# Altium schematic sheet SL530_0.SchDoc: SL530
size 655 x 340 mm; Date: 20.02.2018 21:06:23; SheetNumber: 1
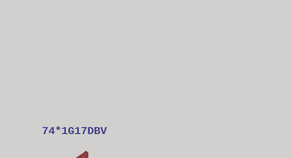
[diagram p0: SL530_0.SchDoc, top left]
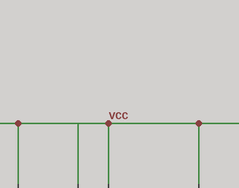
[diagram p1: SL530_0.SchDoc, top right]
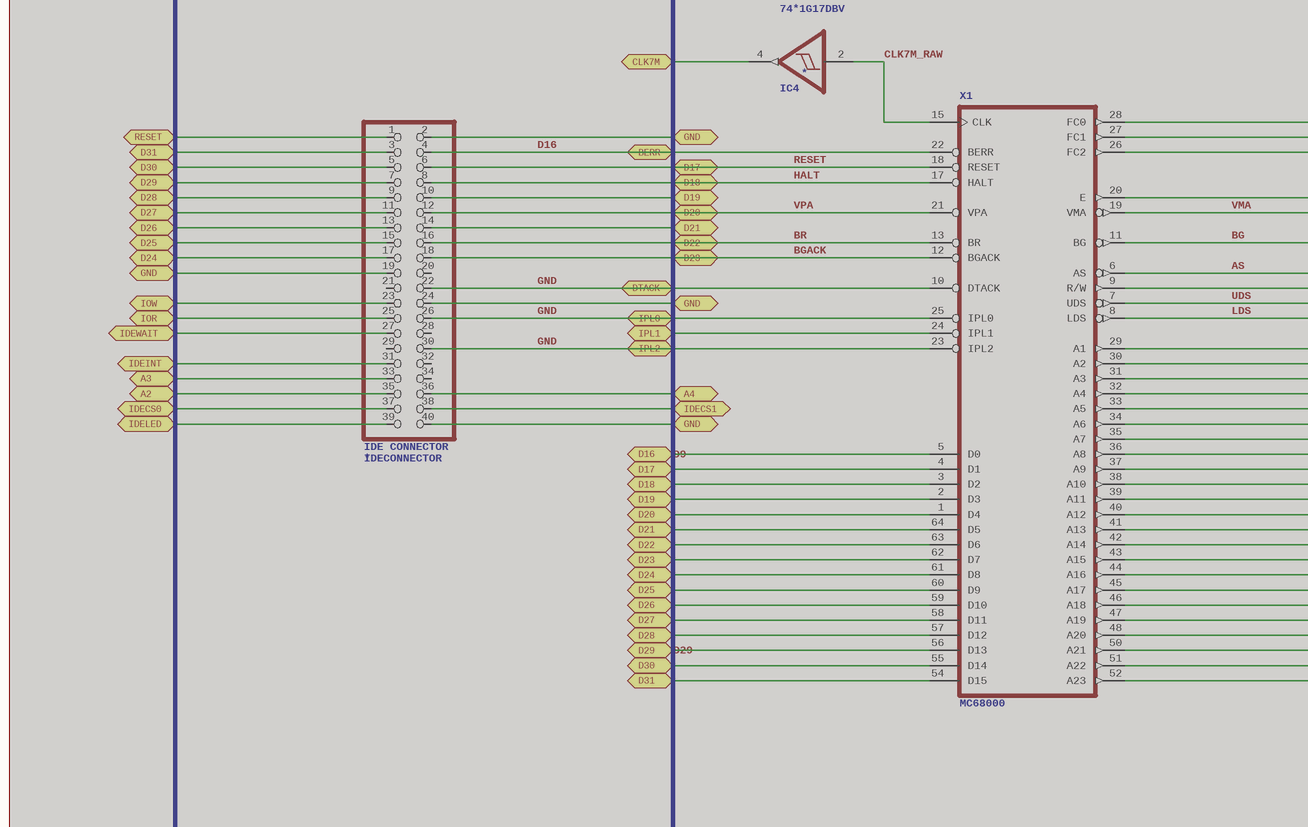
[diagram p2: SL530_0.SchDoc, bottom left]
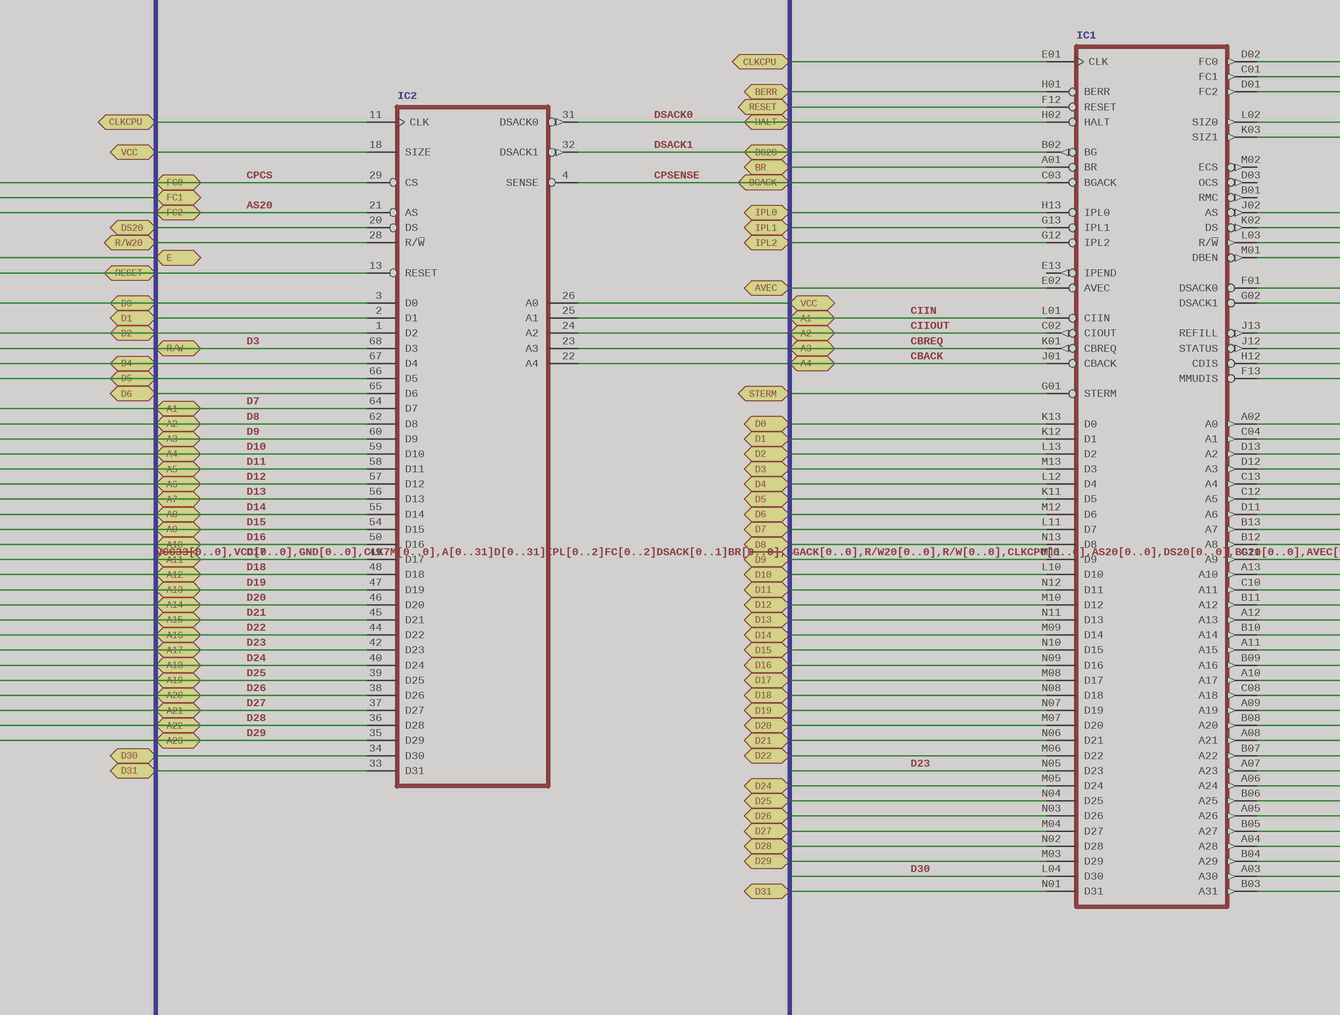
[diagram p3: SL530_0.SchDoc, bottom middle]
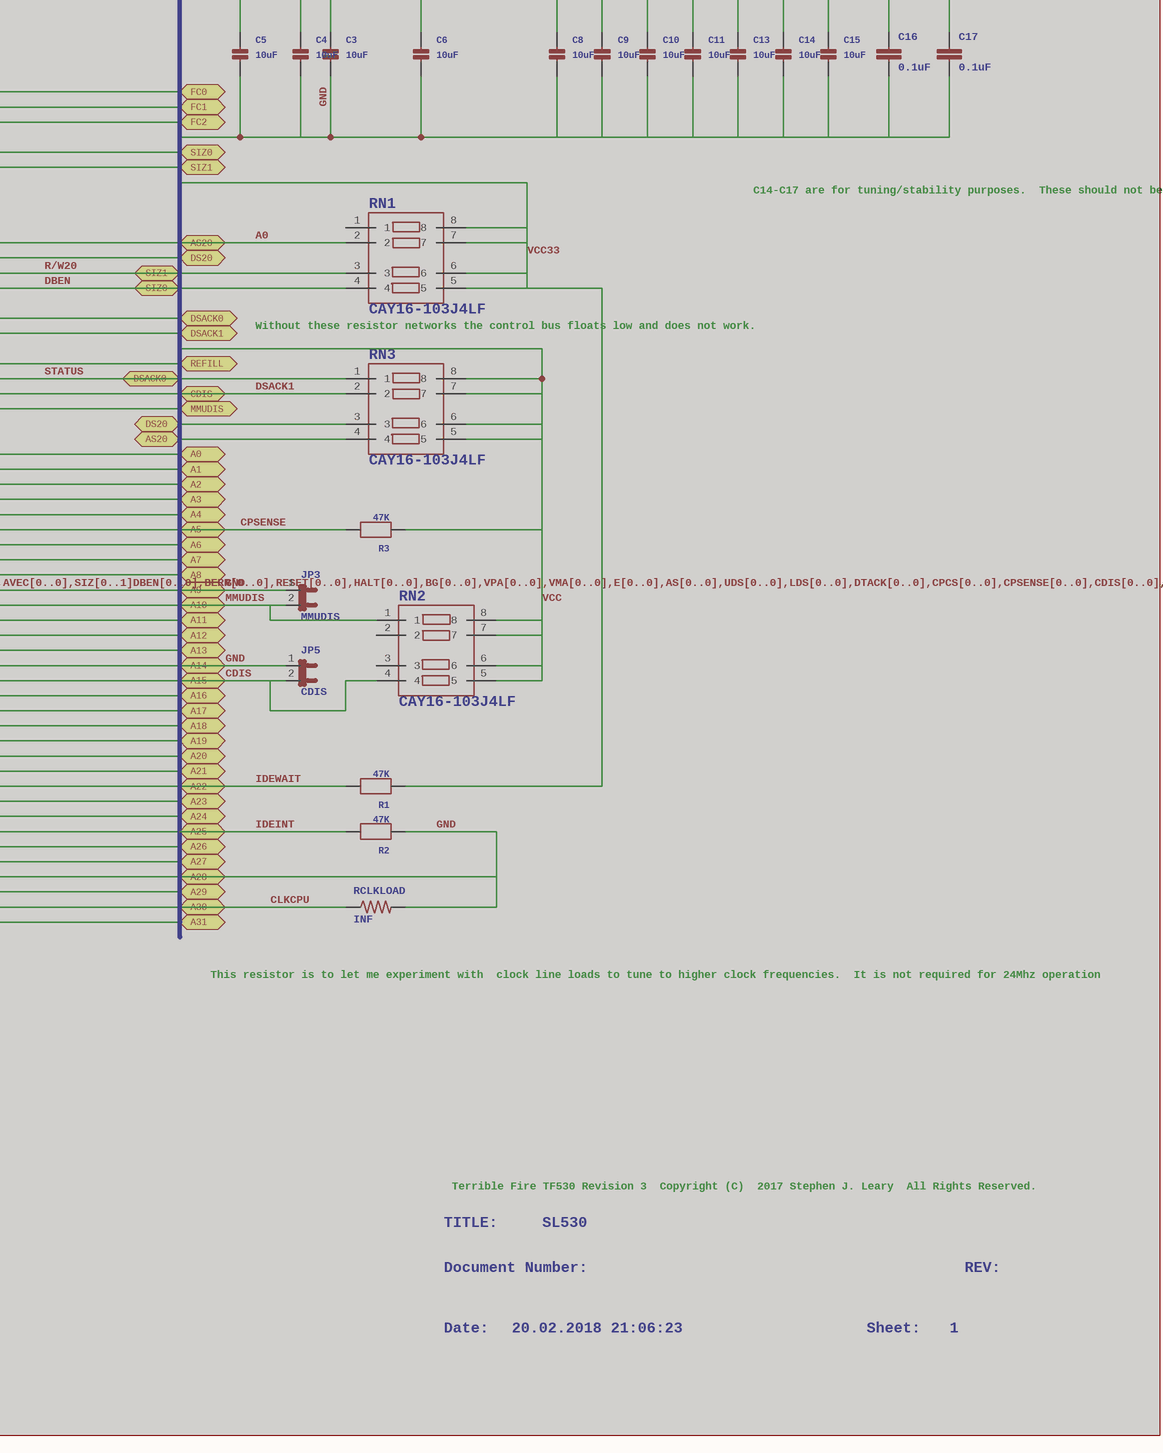
[diagram p4: SL530_0.SchDoc, bottom right]

## Parts
C3  10uF  [1206]  (masked out: inside a compile mask, not in the netlist)
C4  10uF  [1206]  (masked out: inside a compile mask, not in the netlist)
C5  10uF  [1206]  (masked out: inside a compile mask, not in the netlist)
C6  10uF  [1206]  (masked out: inside a compile mask, not in the netlist)
C8  10uF  [1206]  (masked out: inside a compile mask, not in the netlist)
C9  10uF  [1206]  (masked out: inside a compile mask, not in the netlist)
C10  10uF  [1206]  (masked out: inside a compile mask, not in the netlist)
C11  10uF  [1206]  (masked out: inside a compile mask, not in the netlist)
C13  10uF  [1206]  (masked out: inside a compile mask, not in the netlist)
C14  10uF  [1206]  (masked out: inside a compile mask, not in the netlist)
C15  10uF  [1206]  (masked out: inside a compile mask, not in the netlist)
C16  0.1uF  [0603-CAP]  (masked out: inside a compile mask, not in the netlist)
C17  0.1uF  [0603-CAP]  (masked out: inside a compile mask, not in the netlist)
IC1  MC68030RC  [MPGA128]  (value not drawn)  (masked out: inside a compile mask, not in the netlist)
IC2  MC68881FN-SOC  [PLCC68-S]  (value not drawn)  (masked out: inside a compile mask, not in the netlist)
IC4  74*1G17DBV  [SOT23-5]  (masked out: inside a compile mask, not in the netlist)
IDECONNECTOR  IDE CONNECTOR  [2X20]  (masked out: inside a compile mask, not in the netlist)
JP3  MMUDIS  [1X02]  (masked out: inside a compile mask, not in the netlist)
JP5  CDIS  [1X02]  (masked out: inside a compile mask, not in the netlist)
R1  47K  [1206]  (masked out: inside a compile mask, not in the netlist)
R2  47K  [1206]  (masked out: inside a compile mask, not in the netlist)
R3  47K  [1206]  (masked out: inside a compile mask, not in the netlist)
RCLKLOAD  INF  [0603]  (masked out: inside a compile mask, not in the netlist)
RN1  CAY16-103J4LF  [RESCAXE80P320X160-8N]  (masked out: inside a compile mask, not in the netlist)
RN2  CAY16-103J4LF  [RESCAXE80P320X160-8N]  (masked out: inside a compile mask, not in the netlist)
RN3  CAY16-103J4LF  [RESCAXE80P320X160-8N]  (masked out: inside a compile mask, not in the netlist)
X1  MC68000  [DIL64]  (masked out: inside a compile mask, not in the netlist)

## Ports
A0, A1, A2, A3, A4, A5, A6, A7, A8, A9, A10, A11, A12, A13, A14, A15, A16, A17, A18, A19, A20, A21, A22, A23, A24, A25, A26, A27, A28, A29, A30, A31, AS20, AVEC, BERR, BG20, BGACK, BR, CDIS, CLK7M, CLKCPU, D0, D1, D2, D3, D4, D5, D6, D7, D8, D9, D10, D11, D12, D13, D14, D15, D16, D17, D18, D19, D20, D21, D22, D23, D24, D25, D26, D27, D28, D29, D30, D31, DS20, DSACK0, DSACK1, DTACK, E, FC0, FC1, FC2, GND, HALT, IDECS0, IDECS1, IDEINT, IDELED, IDEWAIT, IOR, IOW, IPL0, IPL1, IPL2, MMUDIS, R/W, R/W20, REFILL, RESET, SIZ0, SIZ1, STERM, VCC

## Notes on the sheet
- C14-C17 are for tuning/stability purposes.
  These should not be required for normal operation
  but can be used to help with instability.
- Without these resistor networks the control bus floats low and does not work.
- This resistor is to let me experiment with
  clock line loads to tune to higher clock frequencies.
  It is not required for 24Mhz operation
- TITLE:
- Terrible Fire TF530 Revision 3
  Copyright (C)  2017 Stephen J. Leary
  All Rights Reserved.
- SL530
- Document Number:
- REV:
- Date:
- 20.02.2018 21:06:23
- Sheet:
- 1

## Library data of the parts
C3-C6 C8-C11 C13-C15 = CAP_CERAMIC1206: Ceramic Capacitors0402 - 0402 Surface Mount Capacitors  16pF 50V 5% [Digikey: 445-4899-2-ND]  18pF 50V 5% [Digikey: 490-1281-2-ND]  22pF 50V 5% [Digikey: 490-1283-2-ND]  68pF 50V 5% [Digikey: 490-1289-2-ND]  0.1uF 10V 10% [Digikey: 490-1318-2-ND]  1.0uF 6.3V 10% [Digikey: 490-1320-2-ND]    0603 - 0603 Surface Mount Capacitors  16 pF 50V 5% [Digikey: 445-5051-2-ND]  22 pF 50V [Digikey: PCC220ACVTR-ND]  33 pF 50V 5% [Digikey: 490-1415-1-ND]  56pF 50V 5% [Digikey: 490-1421-1-ND]  220pF 50V 5% [Digikey: 445-1285-1-ND]  680 pF 50V   2200 pF 50V 5% C0G [Digikey: 445-1297-1-ND]  5600 pF 100V 5% X7R [Digikey: 478-3711-1-ND]  0.1 ÂµF 25V 10% [Digikey: PCC2277TR-ND]  0.22 ÂµF 16V 10% X7R [Digikey: 445-1318-1-ND]  1.0 ÂµF 25V 10% [Digikey: 445-5146-2-ND]    0603 - RF Specific  3pF 250V +/-0.1pF RF [Digikey: 712-1347-1-ND]  18 pF 250V 5%  [Digikey: 478-3505-1-ND or 712-1322-1-ND]  56 pF 250V 5% C0G RF [Digikey: 490-4867-1-ND]  68 pF 250V RF [Digikey: 490-4868-1-ND]    0805 - 0805 Surface Mount Capacitors  220 pF 250V 2% RF Ceramic Capacitor [Digikey: 712-1398-1-ND]  1000 pF 50V 2% NP0 Ceramic Capacitor [Digikey: 478-3760-1-ND]  0.1 ÂµF 25V 10% Ceramic Capacitor [Digikey: PCC1828TR-ND]  1.0 ÂµF 16V 10% Ceramic Capacitor[Digikey: 490-1691-2-ND]  10.0 ÂµF 10V 10% Ceramic Capacitor[Digikey: 709-1228-1-ND]  10.0 uF 16V 10% Ceramic Capacitor [Digikey: 478-5165-2-ND]  47 uF 6.3V 20% Ceramic Capacitor [Digikey: 587-1779-1-ND or 399-5506-1-ND]       1206 - 1206 Surface Mount Capacitors  47uF 10V 20% Ceramic Capacitor [Digikey: 490-5528-1-ND or 399-5508-1-ND or 445-6010-1-ND]  100uF 6.3V -20%, +80% Y5V Ceramic Capacitor (Digikey: 490-4512-1-ND, Mouser: 81-GRM31CF50J107ZE1L)
C16 C17 = 0.1UF-25V(+80/-20%)(0603): CAP-00810 Ceramic Standard decoupling cap; PROD_ID: CAP-00810
IC1 = MC68030RC: 68xxx PROCESSOR; MPN: MC68030RC50C; MF: MOTOROLA; OC_FARNELL: unknown; OC_NEWARK: 52F3269
IC2 = MC68881FN-SOC: 68xxx PROCESSOR; MF: *; MPN: *; OC_FARNELL: unknown; OC_NEWARK: unknown
IC4 = 74*1G17DBV: Single Schmitt-Trigger Buffer; NAME: *
IDECONNECTOR = PINHD-2X20: PIN HEADER; NAME: *
JP3 JP5 = JUMPER-2PTH: JumperBasic 0.1" spaced jumper. Use with breakaway headers.
R1-R3 = RESISTOR1206: Resistors0402 - 0402 Surface Mount Package  22 Ohm 1% 1/16W [Digikey: 311-22.0LRTR-ND]  33 Ohm 5% 1/16W  1.0K 5% 1/16W  1.5K 5% 1/16W  2.0K 1% 1/16W  10.0K 1% 1/16W [Digikey: 311-10.0KLRTR-ND]  10.0K 5% 1/16W [Digikey: RMCF0402JT10K0TR-ND]  12.1K 1% 1/16W [Digikey: 311-22.0LRTR-ND]  100.0K 5% 1/16W    0603 - 0603 Surface Mount Package  0 Ohm 1/10 Watt 1% Resistor  15 Ohm 1/10 Watt 1% Resistor  33 Ohm 1/10 Watt 1% Resistor  49.9 Ohm 1/10 Watt 1% Resistor  100 Ohm 1/10 Watt 1% Resistor  150 Ohm 1/10 Watt 1% Resistor  240 Ohm 1/10 Watt 1% Resistor  390 Ohm 1/10 Watt 1% Resistor  560 Ohm 1/10 Watt 1% Resistor  680 Ohm 1/10 Watt 1% Resistor  750 Ohm 1/10 Watt 1% Resistor  1.0K Ohm 1/10 Watt 1% Resistor  1.5K Ohm 1/10 Watt 1% Resistor  2.0K Ohm 1/10 Watt 1% Resistor  2.2K Ohm 1/10 Watt 1% Resistor  3.3K Ohm 1/10 Watt 1% Resistor  4.7K Ohm 1/10 Watt 1% Resistor  10.0K Ohm 1/10 Watt 1% Resistor  12.0K Ohm 1/10 Watt 1% Resistor  12.1K Ohm 1/10 Watt 1% Resistor  20.0K Ohm 1/10 Watt 1% Resistor  33.0K Ohm 1/10 Watt 1% Resistor  100.0K Ohm 1/10 Watt 1% Resistor    0805 - 0805 Surface Mount Package  0 Ohm 1/8 Watt 1% Resistor  33 Ohm 1/8 Watt 1% Resistor  100 Ohm 1/8 Watt 1% Resistor  150 Ohm 1/8 Watt 1% Resistor  200 Ohm 1/8 Watt 1% Resistor  240 Ohm 1/8 Watt 1% Resistor  330 Ohm 1/8 Watt 1% Resistor  390 Ohm 1/8 Watt 1% Resistor  470 Ohm 1/8 Watt 1% Resistor  1.0K Ohm 1/8 Watt 1% Resistor  1.5K Ohm 1/8 Watt 1% Resistor  2.0K Ohm 1/8 Watt 1% Resistor  4.7K Ohm 1/8 Watt 1% Resistor  5.1K Ohm 1/8 Watt 1% Resistor  5.6K Ohm 1/8 Watt 1% Resistor  10.0K Ohm 1/8 Watt 1% Resistor  22.0K Ohm 1/8 Watt 1% Resistor  33.0K Ohm 1/8 Watt 1% Resistor  100K Ohm 1/8 Watt 1% Resistor    1206 - 1206 Surface Mount Package  2012 - 2010 Surface Mount Package  0.11 Ohm 1/2 Watt 1% Resistor - Digikey: RHM.11UCT-ND
RCLKLOAD = 0.05OHM-1/5W-1%(0603): PROD_ID: RES-12535
RN1-RN3 = CAY16-103J4LF: Res Thick Film Array 10K Ohm 5% 200ppm/C ISOL Molded 8-Pin 1206(4 X 0603) Convex SMD Paper T/R; MF: Bourns; AVAILABILITY: Good; MP: CAY16-103J4LF; PACKAGE: 1206 Bourns; PRICE: 0.02 USD
X1 = MC68000P: 68xxx PROCESSOR; MF: *; MPN: *; OC_FARNELL: unknown; OC_NEWARK: unknown